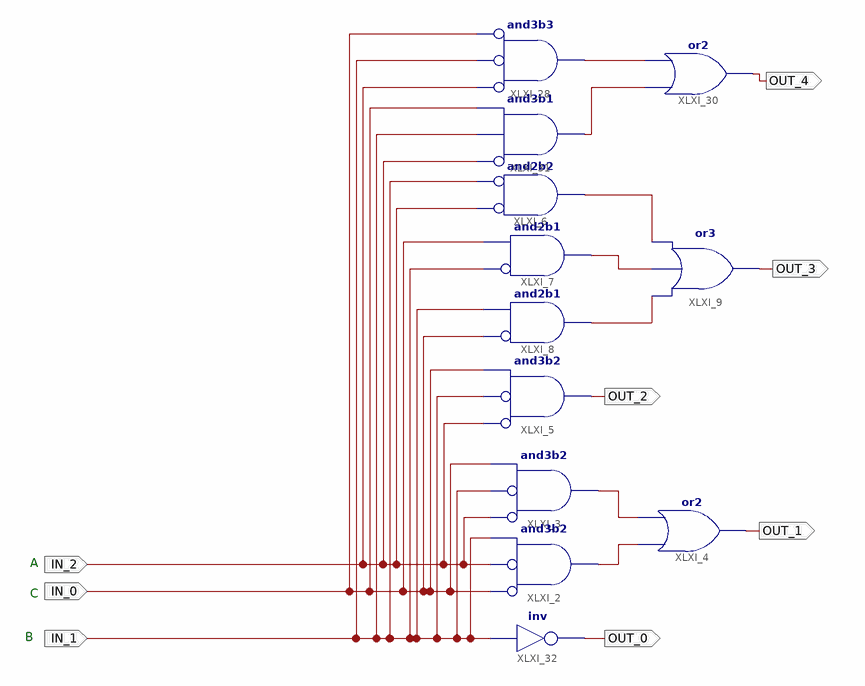
[diagram p0: schematic sheet 1]
// Xilinx ISE schematic My3To5Decoder.sch (spartan3a) as structural Verilog: 12 symbols, 8 ports
module My3To5Decoder (
  input  IN_2,
  input  IN_1,
  input  IN_0,
  output OUT_0,
  output OUT_1,
  output OUT_2,
  output OUT_4,
  output OUT_3
);

  wire XLXN_2, XLXN_3, XLXN_53, XLXN_54, XLXN_55, XLXN_57, XLXN_58;

  and XLXI_2 (XLXN_3, ~IN_0, ~IN_2, IN_1);  // and3b2
  and XLXI_3 (XLXN_2, ~IN_2, ~IN_1, IN_0);  // and3b2
  or XLXI_4 (OUT_1, XLXN_3, XLXN_2);
  and XLXI_5 (OUT_2, ~IN_2, ~IN_1, IN_0);  // and3b2
  and XLXI_6 (XLXN_55, ~IN_2, ~IN_1);  // and2b2
  and XLXI_8 (XLXN_53, ~IN_0, IN_1);  // and2b1
  and XLXI_7 (XLXN_54, ~IN_1, IN_0);  // and2b1
  or XLXI_9 (OUT_3, XLXN_53, XLXN_54, XLXN_55);
  and XLXI_28 (XLXN_58, ~IN_2, ~IN_1, ~IN_0);  // and3b3
  or XLXI_30 (OUT_4, XLXN_57, XLXN_58);
  and XLXI_31 (XLXN_57, ~IN_2, IN_1, IN_0);  // and3b1
  not XLXI_32 (OUT_0, IN_1);

  // Notes on the sheet:
  //   A
  //   C
  //   B
endmodule
